# Altium schematic sheet 01_Microcontroller_Circuit.SchDoc
size A; SheetNumber: 2; SheetTotal: 8
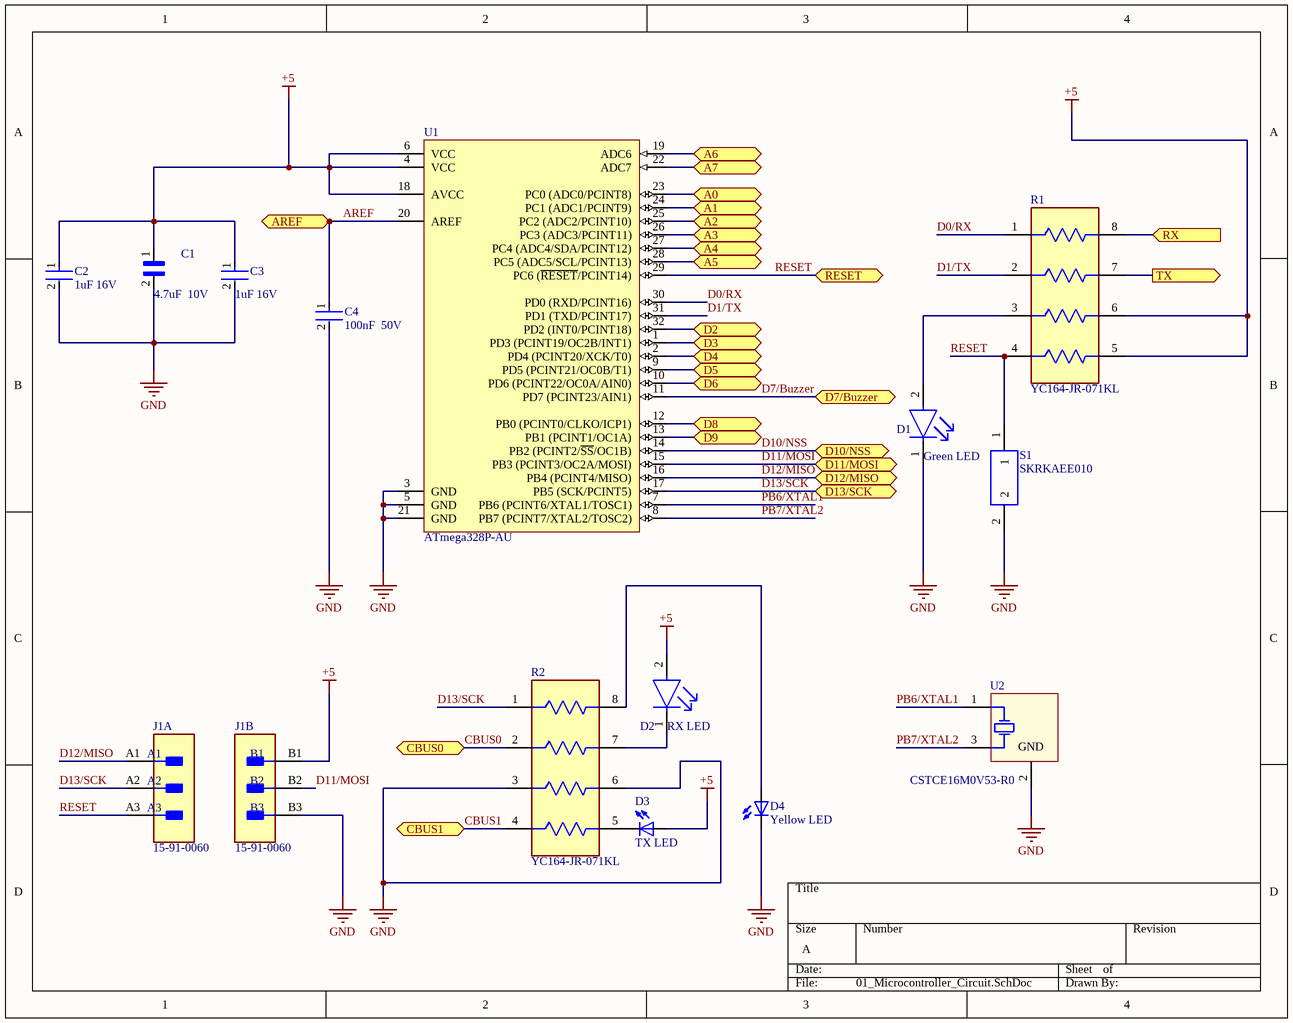
[diagram p0: 01_Microcontroller_Circuit.SchDoc]

## Parts
C1  4.7uF  10V  [CAPC1608X90]
C2  1uF 16V  [FP-CL10B105KO8NNNC-MFG]
C3  1uF 16V  [FP-CL10B105KO8NNNC-MFG]
C4  100nF  50V  [FP-0805-L_2_01_0_2-W_1_25-IPC_C]
D1  Green LED  [FP-LTST-C171KGKT-MFG]
D2  RX LED  [FP-LTST-C171KGKT-MFG]
D3  TX LED  [DIOC200X125X110]
D4  Yellow LED  [DIOC200X125X110]
J1  15-91-0060  [FP-15-91-0060-MFG]  (parts A,B of 2)
R1  YC164-JR-071KL  [FP-YC164-MFG]
R2  YC164-JR-071KL  [FP-YC164-MFG]
S1  SKRKAEE010  [SKRK]
U1  ATmega328P-AU  [32A_M]
U2  CSTCE16M0V53-R0  [MURA-CSTCE_V-3_V]

## Ports
A0 (bidir, see 00_Overview[2B], 04_Pin_Headers[3C]), A1 (bidir, see 00_Overview[2B], 04_Pin_Headers[3C]), A2 (bidir, see 00_Overview[2B], 04_Pin_Headers[3B]), A3 (bidir, see 00_Overview[2B], 04_Pin_Headers[3B]), A4 (bidir, see 00_Overview[2B], 04_Pin_Headers[3B]), A5 (bidir, see 00_Overview[2B], 04_Pin_Headers[3B]), A6 (bidir, see 00_Overview[2B], 04_Pin_Headers[3B]), A7 (bidir, see 00_Overview[2B], 04_Pin_Headers[3B]), AREF (bidir, see 00_Overview[2C], 04_Pin_Headers[3C]), CBUS0 (bidir, see 00_Overview[3B], 03_Mini_USB_Circuit[3B]), CBUS1 (bidir, see 00_Overview[3B], 03_Mini_USB_Circuit[3B]), D2 (bidir, see 00_Overview[2B], 04_Pin_Headers[1A]), D3 (bidir, see 00_Overview[2B], 04_Pin_Headers[1B]), D4 (bidir, see 00_Overview[2B], 04_Pin_Headers[1B]), D5 (bidir, see 00_Overview[2B], 04_Pin_Headers[1B]), D6 (bidir, see 00_Overview[2C], 04_Pin_Headers[1B]), D7/Buzzer (bidir, see 00_Overview[2C], 04_Pin_Headers[2D]), D8 (bidir, see 00_Overview[2C], 04_Pin_Headers[1B]), D9 (bidir, see 00_Overview[2C], 04_Pin_Headers[1B]), D10/NSS (bidir, see 00_Overview[3C], 06_Logic_Level_Shifters[2B]), D11/MOSI (bidir, see 00_Overview[3C], 06_Logic_Level_Shifters[4B]), D12/MISO (bidir, see 00_Overview[3C], 06_Logic_Level_Shifters[2C]), D13/SCK (bidir, see 00_Overview[3C], 06_Logic_Level_Shifters[4C]), RESET (bidir, see 00_Overview[3B], 03_Mini_USB_Circuit[4B], 04_Pin_Headers[1A]), RX (in, see 00_Overview[3B], 03_Mini_USB_Circuit[3A]), TX (out, see 00_Overview[3B], 03_Mini_USB_Circuit[3B])

## Nets
+5: C1.1 C2.1 C3.1 D2.2(A) D3.POS J1.B1 R1.5 R1.6 U1.4(VCC) U1.6(VCC) U1.18(AVCC)
GND: C1.2 C2.2 C3.2 C4.2 D1.1(C) D4.NEG J1.B3 R2.3 R2.6 S1.2 U1.3(GND) U1.5(GND) U1.21(GND) U2.2(GND)
A0: U1.23(PC0_(ADC0/PCINT8)) ; port A0
A1: U1.24(PC1_(ADC1/PCINT9)) ; port A1
A2: U1.25(PC2_(ADC2/PCINT10)) ; port A2
A3: U1.26(PC3_(ADC3/PCINT11)) ; port A3
A4: U1.27(PC4_(ADC4/SDA/PCINT12)) ; port A4
A5: U1.28(PC5_(ADC5/SCL/PCINT13)) ; port A5
A6: U1.19(ADC6) ; port A6
A7: U1.22(ADC7) ; port A7
AREF: C4.1 U1.20(AREF) ; port AREF
CBUS0: R2.2 ; port CBUS0
CBUS1: R2.4 ; port CBUS1
D0/RX: R1.1 U1.30(PD0_(RXD/PCINT16))
D1/TX: R1.2 U1.31(PD1_(TXD/PCINT17))
D2: U1.32(PD2_(INT0/PCINT18)) ; port D2
D3: U1.1(PD3_(PCINT19/OC2B/INT1)) ; port D3
D4: U1.2(PD4_(PCINT20/XCK/T0)) ; port D4
D5: U1.9(PD5_(PCINT21/OC0B/T1)) ; port D5
D6: U1.10(PD6_(PCINT22/OC0A/AIN0)) ; port D6
D7/Buzzer: U1.11(PD7_(PCINT23/AIN1)) ; port D7/Buzzer
D8: U1.12(PB0_(PCINT0/CLKO/ICP1)) ; port D8
D9: U1.13(PB1_(PCINT1/OC1A)) ; port D9
D10/NSS: U1.14(PB2_(PCINT2/~{SS}/OC1B)) ; port D10/NSS
D11/MOSI: J1.B2 U1.15(PB3_(PCINT3/OC2A/MOSI)) ; port D11/MOSI
D12/MISO: J1.A1 U1.16(PB4_(PCINT4/MISO)) ; port D12/MISO
D13/SCK: J1.A2 R2.1 U1.17(PB5_(SCK/PCINT5)) ; port D13/SCK
PB6/XTAL1: U1.7(PB6_(PCINT6/XTAL1/TOSC1)) U2.1(C1)
PB7/XTAL2: U1.8(PB7_(PCINT7/XTAL2/TOSC2)) U2.3(C2)
RESET: J1.A3 R1.4 S1.1 U1.29(PC6_(~{RESET}/PCINT14)) ; port RESET
RX: R1.8 ; port RX
TX: R1.7 ; port TX
NetD1_2: D1.2(A) R1.3
NetD2_1: D2.1(C) R2.7
NetD3_NEG: D3.NEG R2.5
NetD4_POS: D4.POS R2.8

## Library data of the parts
C1 = CC0603ZRY5V5BB475: SnapEDA_Link: https://www.snapeda.com/parts/CC0603ZRY5V5BB475/Yageo/view-part/?ref=snap; Check_prices: https://www.snapeda.com/parts/CC0603ZRY5V5BB475/Yageo/view-part/?ref=eda; Value: *
C2 C3 = CMP-2000-06093-2: CAP CER 1UF 16V X7R 0603; Manufacturer: Samsung Electro-Mechanics America, Inc; Manufacturer Part Number: CL10B105KO8NNNC; Temperature Coefficient: 15%; Material: Ceramic; Tolerance: 10%; Voltage Rating: 16V; Automotive: No; ComponentLink2Description: Datasheet; Device Class L3: Ceramic Capacitors; Capacitance: 1uF; Temperature Characteristic: X7R; Temperature Range High: +125°C; Digikey Description: CAP CER 1UF 16V X7R 0603; Device Class L2: Capacitors; Octopart: https://octopart.com/cl10b105ko8nnnc-samsung-19018973; ComponentLink2URL: http://www.samsungsem.com/global/front/downloadcms.do?path=%2F%2Fglobal%2F%2Fsupport%2F%2Fproduct-search%2F%2Fmlcc%2F%2F__icsFiles%2F%2Fafieldfile%2F%2F2019%2F%2F06%2F%2F18&fileName=CL10B105KO8NNNC-19.pdf; Lead Free: Yes; Height: 0.9mm; Package: CL10B105KO8NNNC; Temperature Range Low: -55°C; Value: 1uF; Device Class L1: Passive Components; RoHS: TRUE; Temperature: -55°C to +125°C; Category: Cap; Ipc Land Pattern Name: CAPC16080X80
C4 = CMP-2000-05016-2: General Purpose Ceramic Capacitor, 0805, 100nF, 10%, X7R, 0.15, 50V; Dissipation Factor: 2.5%; Insulation Resistance: 100GR; Voltage Rating (DC): 50V; Package Quantity: 4000; Tolerance: 10%; Voltage Rating: 50V; Dielectric: X7R; Case/Package: 0805; Lead Free: Lead Free; Dielectric Material: Ceramic; Thickness: 0.037inch; Weight: 0.001411oz; Max Operating Temperature: 125°C; REACH SVHC: No SVHC; Mount: Surface Mount; RoHS Compliant: Yes; Depth: 1.25mm; Height: 0.5mm; Case Code (Metric): 2012; Length: 2mm; Termination: Standard; Case Code (Imperial): 0805; Number of Pins: 2; Voltage: 50V; Radiation Hardening: No; Min Operating Temperature: -55°C; Capacitance: 100nF; Width: 1.2mm; Series: MLCC X7R; Packaging: Cut Tape
D1 D2 = CMP-22017-000037-1: LED GREEN CLEAR SMD; Number of LEDs: 1; Viewing Angle: 130°; Lens Style: Rectangular; Dominant Wavelength: 571nm; Test Current: 20mA; Luminous Intensity: 35mcd; Power Rating: 75mW; Forward Voltage: 2.4V; Forward Current: 30mA; Reverse Voltage: 5V; Lens Color: Colorless; Wavelength: 574nm; Height: 0.8mm; Illumination Color: Green; Length: 2mm; Case/Package: 0805; Number of Pins: 2; Number of Elements: 1; Package Quantity: 1; Depth: 1.25mm; Lens Transparency: Clear; Width: 1.25mm; Color: Green; Radiation Hardening: No; Mount: Surface Mount; Packaging: Tape and Reel; Case Code (Metric): 2012; Lead Free: Lead Free; Max Operating Temperature: 85°C; Min Operating Temperature: -55°C; Case Code (Imperial): 0805; Power Dissipation: 75mW
D3 D4 = LTST-C171KSKT: Yellow 587nm LED Indication - Discrete 2V 0805 (2012 Metric); MF: Lite-On Inc.; SnapEDA_Link: https://www.snapeda.com/parts/LTST-C171KSKT/Lite-On/view-part/?ref=snap; Package: 0805 Lite-On; Value: *; MP: LTST-C171KSKT; Check_prices: https://www.snapeda.com/parts/LTST-C171KSKT/Lite-On/view-part/?ref=eda
J1 = CMP-04776-000883-1: CONN HEADER SMD 6POS 2.54MM; Current Rating: 3A; Voltage Rating: 250V; Number of Positions: 6; Glow Wire Compliant: Non-compliant; Gender: Male; Max Voltage Rating (DC): 250.25kV; Package Quantity: 3000; Contact Plating: Gold; Halogen Free: Low Halogen; Mount: Surface Mount; Row Spacing: 2.54mm; Contact Material: Bronze; Number of Rows: 2; Min Operating Temperature: -40°C; Pitch: 2.54mm; Packaging: Bulk; Termination: SMD/SMT; Contact Gender: Male; Max Operating Temperature: 105°C; Voltage Rating (DC): 250V; Flammability Rating: UL94 V-0; Series: 71308; Number of Contacts: 6; Housing Material: Thermoplastic; Radiation Hardening: No; ELV: Compliant; Number of Circuits: 6; Housing Color: Black; Material: Bronze; Orientation: Straight; Lead Free: Lead Free
R1 R2 = CMP-03411-000004-1: RES ARRAY 4 RES 1K OHM 1206; Number of Terminals/Pins: 8; Resistance Tolerance: 5%; Temperature Coefficient: 200ppm/°C; Number of Circuits: 4; Resistance: 1kR; Power Per Element: 62.5mW; Voltage Rating: 50V; Circuit Type: Isolated; Case/Package: 0603; RoHS Compliant: Yes; Size Code: 0603; Tolerance: 5%; Min Operating Temperature: -55°C; Height: 0.028inch; Series: YC164; Number of Elements: 4; Length: 0.126inch; Number of Pins: 8; Number of Resistors: 4; Lead Free: Lead Free; Radiation Hardening: No; Max Operating Temperature: 155°C; Case Code (Metric): 3216; Working Voltage: 50V; Case Code (Imperial): 1206; Packaging: Cut Tape; Technology: THICK FILM; Number of Contacts: 8; Width: 0.063inch; Depth: 1.6mm; Terminal Pitch: 0.8mm; Power Dissipation: 62.5mW; Package Quantity: 1; Termination: Convex; Mount: Surface Mount; Military Standard: Not
S1 = SKRKAEE010: Switch Tactile N.O. SPST Round Button Gull Wing 0.05A 12VDC 1.57N SMD T/R; MF: ALPS; Availability: Unavailable; Price: None; Package: None; Value: *; SnapEDA_Link: https://www.snapeda.com/parts/SKRKAEE010/ALPS/view-part/380772/?ref=snap; MP: SKRKAEE010
U1 = CMP-0095-00269-2: 8-bit AVR Microcontroller, 32KB Flash, 1KB EEPROM, 2KB SRAM, 32-pin TQFP, Industrial Grade (-40°C to 85°C); PackageDescription: 32-Lead, 7x7x1.0 mm Body, 0.8mm Lead Pitch, Thin Profile Plastic Quad Flat Package (TQFP); DatasheetVersion: revD, May-2011; RevisionNote: DatasheetVersion & PackageVersion updated. URLs added.; ComponentLink1URL: http://www.atmel.com/; ComponentLink2Description: ATmega48A/48PA/88A/88PA/168A/168PA/328/328P Datasheet; Code_JEDEC: MS-026-ABA; ComponentLink1Description: Manufacturer URL; PackageReference: 32A; ComponentLink3Description: ATmega48A/48PA/88A/88PA/168A/168PA/328/328P Summary; ComponentLink2URL: http://www.atmel.com/dyn/resources/prod_documents/doc8271.pdf; PackageVersion: revC, Oct-2010; ComponentLink3URL: http://www.atmel.com/dyn/resources/prod_documents/8271S.pdf
U2 = CMP-0588-00001-2: Ceramic Resonator, 16 MHz with Built-in Capacitance, Thickness Expander Mode, Initial Frequency Tolerance +/- 0.5%, Load Capacity 15 pF, -20 to 80 degC, 3.2 x 1.3 x 1 mm SMD, RoHS, Reel; Manufacturer: Murata; Oscillating Frequency: 16 MHz; Load Capacity: 15 pF; PackageDescription: 3-Pin SMD, Body 3.2 x 1.3 mm, Pitch 0.95 mm; Mounting Technology: Surface Mount; ComponentLink1URL: http://www.murata.com/; RoHS: TRUE; Packing: Reel; Initial Frequency Tolerance: +/- 0.5%; PartNumber: CSTCE16M0V53-R0; ComponentLink2Description: Datasheet; DatasheetVersion: Rev. P16E-22; PackageReference: CSTCE_V-3; Operating Temperature Range: -20 to 80 degC; ComponentLink2URL: http://www.murata.com/products/catalog/pdf/p16e.pdf; ComponentLink1Description: Manufacturer URL; Initial Tolerance: +/- 0.5%